# EAGLE design uknc_sd_fdd (EAGLE 6.6.0)
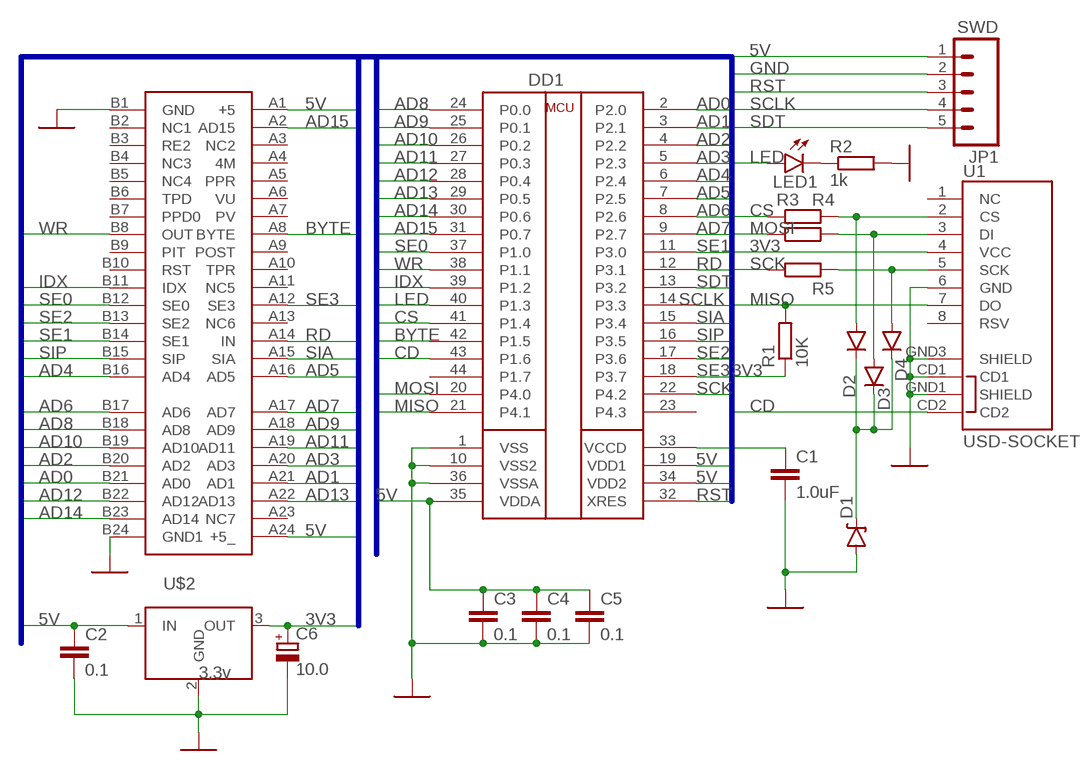
[diagram p0: schematic, sheet 1]

## Parts
C1  1.0uF  1.0UF-25V-+80/-20(0805)"  [0805-CAP]
C2  0.1  C-EUC0805  [C0805]
C3  0.1  C-EUC0805  [C0805]
C4  0.1  C-EUC0805  [C0805]
C5  0.1  C-EUC0805  [C0805]
C6  10.0  CPOL-EUE1.8-4  [E1,8-4]
D1  DIODE-ZENERPTH  [DIODE-ZENER]
D2  DIODEPTH  [DIODE-1N4001]
D3  DIODEPTH  [DIODE-1N4001]
D4  DIODEPTH  [DIODE-1N4001]
DD1  CY8C4245AXI  [TQFP-44]
JP1  SWD  M05PTH  [1X05]
LED1  LED1206  [LED-1206]
R1  10K  R-EU_M0805  [M0805]
R2  1k  R-EU_R0805  [R0805]
R3  R-EU_R0805  [R0805]
R4  R-EU_R0805  [R0805]
R5  R-EU_R0805  [R0805]
U1  USD-SOCKET  [MICROSD_1:1]
U$1  SNP  [SNP15-48-BOARD]
U$2  3.3v  1235B  [1235B]

## Nets
3V3: C6.+ R1.1 U1.4(VCC) U$2.3(OUT)
5V: C2.1 C3.1 C4.1 C5.1 DD1.19(VDD1) DD1.34(VDD2) DD1.35(VDDA) JP1.1 U$1.A1(+5) U$1.A24(+5_) U$2.1(IN)
AD0: DD1.2(P2.0) U$1.B21(AD0)
AD1: DD1.3(P2.1) U$1.A21(AD1)
AD2: DD1.4(P2.2) U$1.B20(AD2)
AD3: DD1.5(P2.3) U$1.A20(AD3)
AD4: DD1.6(P2.4) U$1.B16(AD4)
AD5: DD1.7(P2.5) U$1.A16(AD5)
AD6: DD1.8(P2.6) U$1.B17(AD6)
AD7: DD1.9(P2.7) U$1.A17(AD7)
AD8: DD1.24(P0.0) U$1.B18(AD8)
AD9: DD1.25(P0.1) U$1.A18(AD9)
AD10: DD1.26(P0.2) U$1.B19(AD10)
AD11: DD1.27(P0.3) U$1.A19(AD11)
AD12: DD1.28(P0.4) U$1.B22(AD12)
AD13: DD1.29(P0.5) U$1.A22(AD13)
AD14: DD1.30(P0.6) U$1.B23(AD14)
AD15: DD1.31(P0.7) U$1.A2(AD15)
BYTE: DD1.42(P1.5) U$1.A8(BYTE)
CD: DD1.43(P1.6) U1.CD2
CS: DD1.41(P1.4) R3.1
GND: C1.2 C2.2 C3.2 C4.2 C5.2 C6.- D1.P$2(A) DD1.1(VSS) DD1.10(VSS2) DD1.36(VSSA) JP1.2 R2.2 U1.6(GND) U1.CD1 U1.GND1(SHIELD) U1.GND3(SHIELD) U$1.B1(GND) U$1.B24(GND1) U$2.2(GND)
IDX: DD1.39(P1.2) U$1.B11(IDX)
LED: DD1.40(P1.3) LED1.A
MISO: DD1.21(P4.1) R1.2 U1.7(DO)
MOSI: DD1.20(P4.0) R4.1
N$1: C1.1 DD1.33(VCCD)
N$2: D1.P$1(C) D2.C D3.C D4.C
N$3: LED1.C R2.1
N$4: D2.A R3.2 U1.2(CS)
N$5: D3.A R4.2 U1.3(DI)
N$6: D4.A R5.2 U1.5(SCK)
RD: DD1.12(P3.1) U$1.A14(IN)
RST: DD1.32(XRES) JP1.3
SCK: DD1.22(P4.2) R5.1
SCLK: DD1.14(P3.3) JP1.4
SDT: DD1.13(P3.2) JP1.5
SE0: DD1.37(P1.0) U$1.B12(SE0)
SE1: DD1.11(P3.0) U$1.B14(SE1)
SE2: DD1.17(P3.6) U$1.B13(SE2)
SE3: DD1.18(P3.7) U$1.A12(SE3)
SIA: DD1.15(P3.4) U$1.A15(SIA)
SIP: DD1.16(P3.5) U$1.B15(SIP)
WR: DD1.38(P1.1) U$1.B8(OUT)
Unconnected: DD1.23(P4.3) DD1.44(P1.7) U1.1(NC) U1.8(RSV) U$1.A3(NC2) U$1.A4(4M) U$1.A5(PPR) U$1.A6(VU) U$1.A7(PV) U$1.A9(POST) U$1.A10(TPR) U$1.A11(NC5) U$1.A13(NC6) U$1.A23(NC7) U$1.B2(NC1) U$1.B3(RE2) U$1.B4(NC3) U$1.B5(NC4) U$1.B6(TPD) U$1.B7(PPD0) U$1.B9(PIT) U$1.B10(RST)

## Buses
B$1

## Library data of the parts
C1 = SparkFun-Capacitors:1.0UF-25V-+80/-20(0805): CAP-11625; PROD_ID: CAP-11625
C2-C5 = resistor:C-EU: CAPACITOR, European symbol
C6 = resistor:CPOL-EU: POLARIZED CAPACITOR, European symbol
D1 = SparkFun-DiscreteSemi:DIODE-ZENER: Zener Diode Production Part - 8199 3.4V Zener Voltage
D2-D4 = SparkFun-DiscreteSemi:DIODE: Diode These are standard reverse protection diodes and small signal diodes. SMA package can handle up to about 1A. SOD-323 can handle about 200mA. What the SOD-323 package when ordering, there are some mfgs out there that are 5-pin packages.
DD1 = CYP:CY8C4245AXI: CY8C4245AXI IN TQFP-44 PACKAGE
JP1 = SparkFun-Connectors:M05: Header 5 Standard 5-pin 0.1" header. Use with straight break away headers (SKU : PRT-00116), right angle break away headers (PRT-00553), swiss pins (PRT-00743), machine pins (PRT-00117), and female headers (PRT-00115). Molex polarized connector foot print use with SKU : PRT-08230 with associated crimp pins and housings.
LED1 = SparkFun-LED:LED: LEDs Standard schematic elements and footprints for 5mm, 3mm, 1206, and 0603 sized LEDs. 5mm - Spark Fun Electronics SKU : COM-00529 (and others)
R1-R5 = resistor:R-EU_: RESISTOR, European symbol
U1 = SparkFun-Connectors:USD-SOCKET: microSD Socket Push-push type uSD socket. Schematic element and footprint production proven. Spark Fun Electronics SKU : PRT-00127. tDoc lines correctly indicate media card edge positions when inserting (unlocked, locked, depressed). NOTE: CD1 and CD2 are connected internally; PROD_ID: CONN-07820
U$1 = connectors:SNP
U$2 = stab:1235B: Belarussian 3.3v stabilizer

## Board
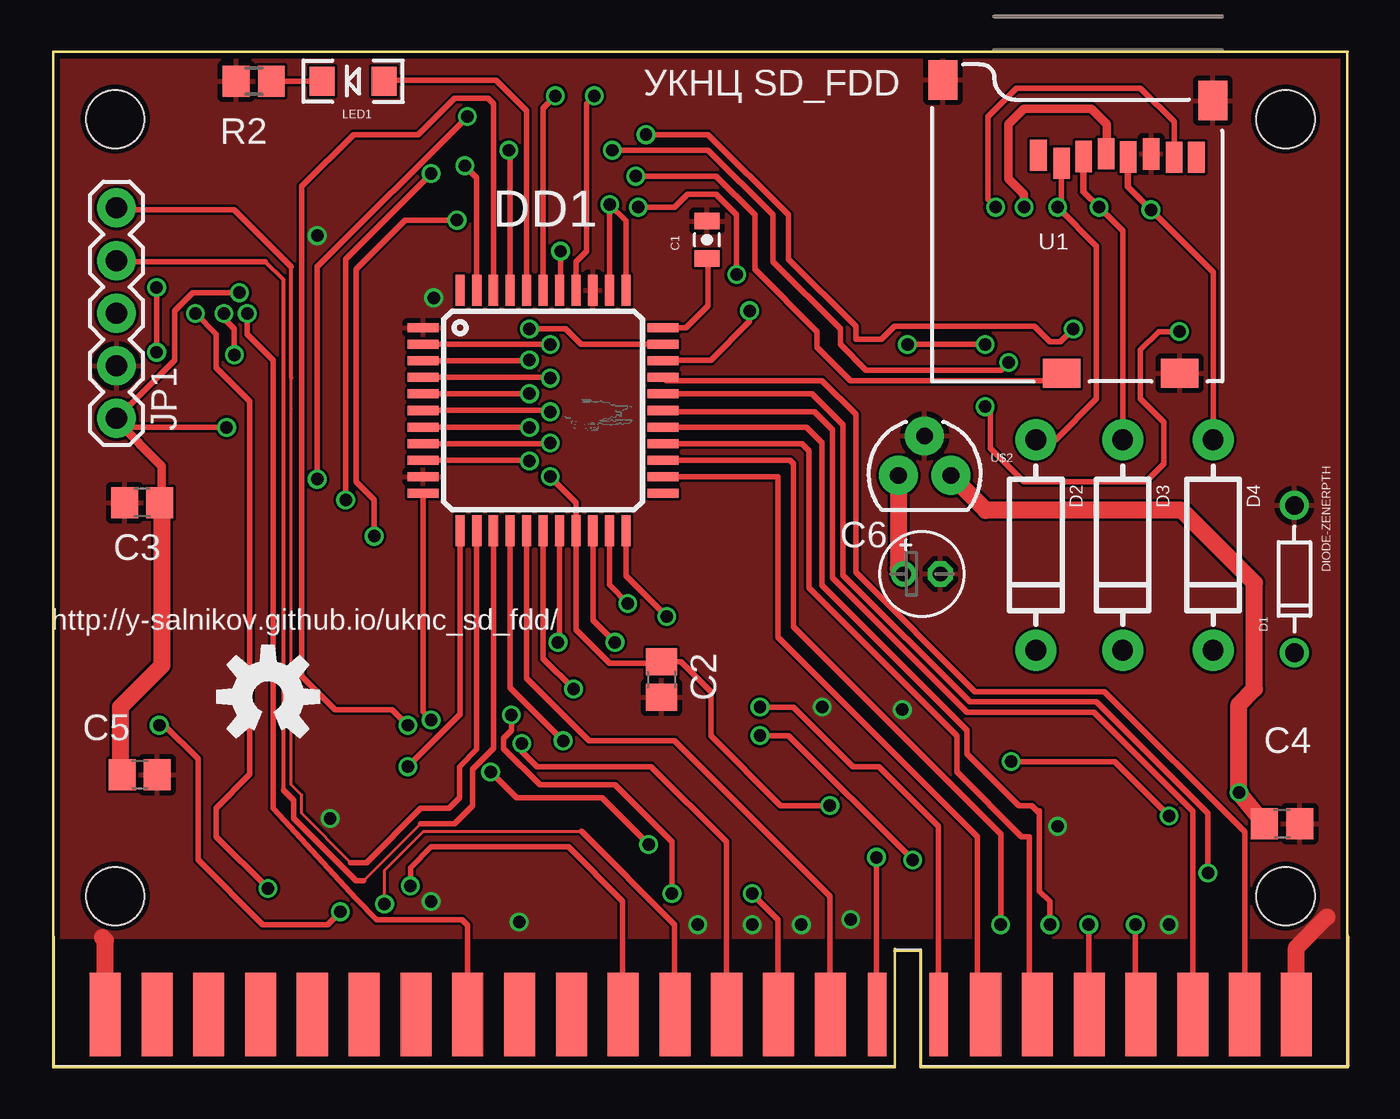
[diagram p1: board, top side]
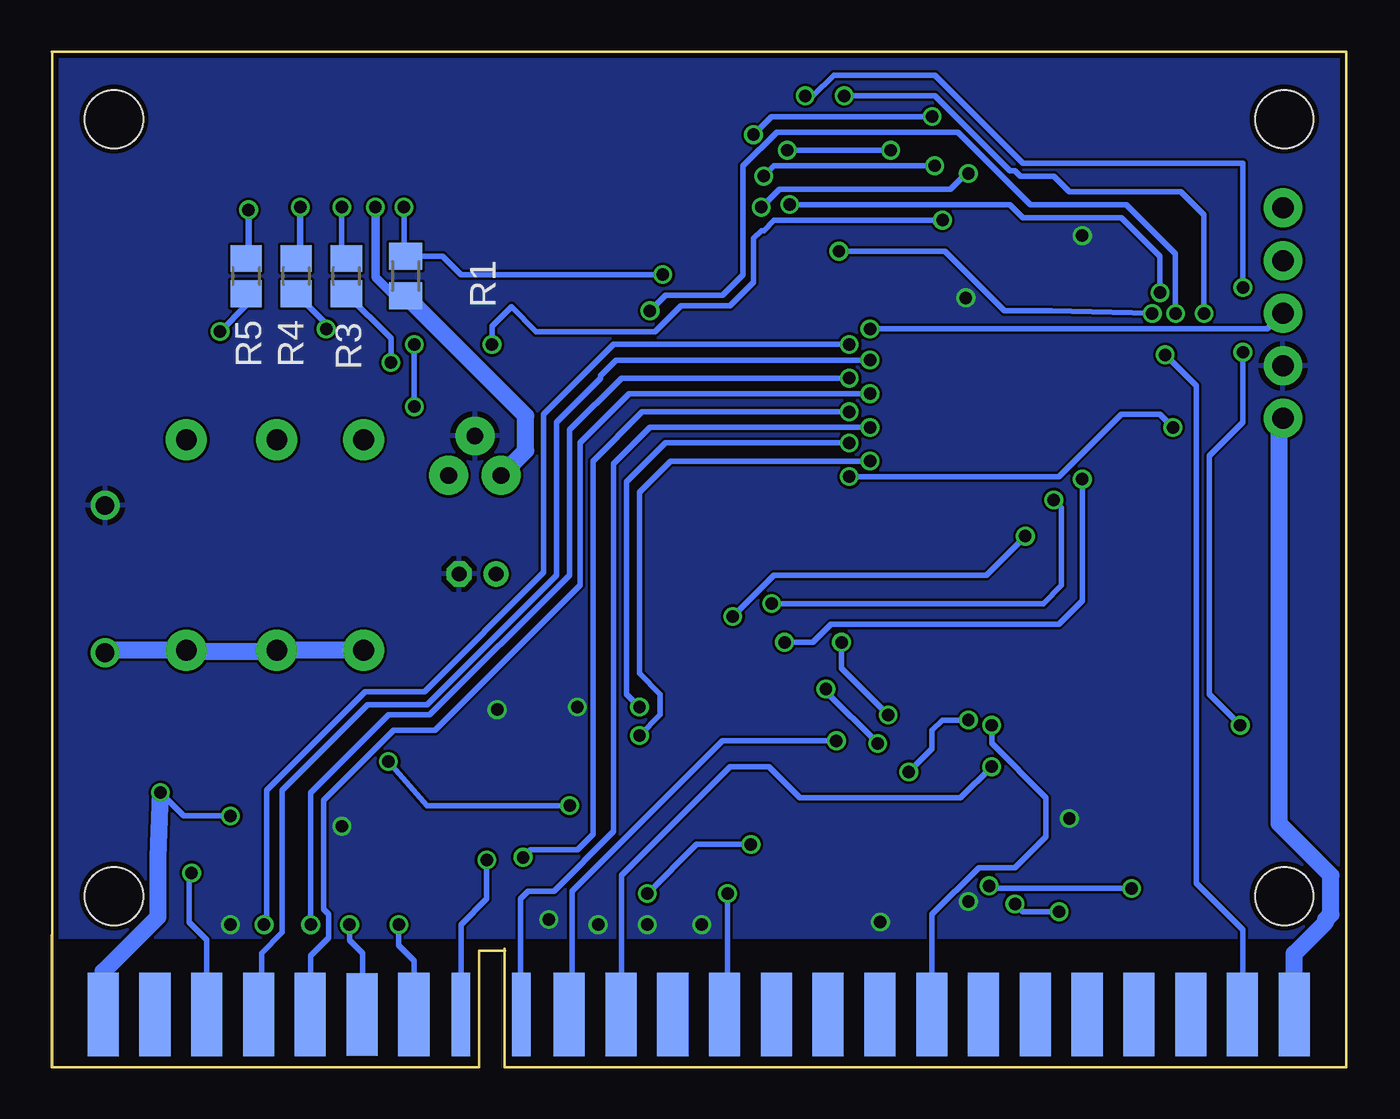
[diagram p2: board, bottom side, seen from below]

Size 62.5 x 49 mm. Coordinates in mm from the lower left corner, seen from the top.
Outline: 62.48,0 62.48,49
Outline: 40.64,5.71 40.64,0 0,0 0,49 62.5,49
Outline: 40.62,5.62 41.88,5.62 41.88,0 62.48,0
Outline: 62.48,0 62.5,0 62.5,6.38
Copper layers (1*16): Top 0.035mm / dielectric 1.5mm / Bottom 0.035mm
Design rules "dirt_cheap_dirty_boards.v1": minimum track width 5mil, minimum drill 12mil, track to track 5mil, track to pad 5mil, pad to pad 5mil, via to via 5mil, smd to smd 0mil, copper to edge 10mil, drill to drill 10mil, minimum pad ring 10mil, minimum via ring 6mil, stop-mask expansion 2mil, vias tented up to drill 25mil, thermal gap 10mil
Holes 2.8 mm at 3,45.75 59.5,45.75 3,8.25 59.5,8.25

### Footprints (pad centres in the part's own frame; a part is rotated, then mirrored left to right if it is on the bottom)
0805-CAP = smd 0.8 x 1.2: 1 -0.9,0; 2 0.9,0
C0805 = smd 1.3 x 1.5: 1 -0.85,0; 2 0.85,0
E1,8-4 = drill 0.711 pad 1.168: + -0.889,0 | drill 0.711 pad 1.168 octagon: - 0.889,0
DIODE-ZENER = drill 0.9: P$1 -3.556,0; P$2 3.556,0
DIODE-1N4001 = drill 1 pad 1.981: A -5.08,0; C 5.08,0
TQFP-44 = smd 1.5 x 0.44: 1 -5.8,4; 2 -5.8,3.2; 3 -5.8,2.4; 4 -5.8,1.6; 5 -5.8,0.8; 6 -5.8,0; 7 -5.8,-0.8; 8 -5.8,-1.6; 9 -5.8,-2.4; 10 -5.8,-3.2; 11 -5.8,-4; 23 5.8,-4; 24 5.8,-3.2; 25 5.8,-2.4; 26 5.8,-1.6; 27 5.8,-0.8; 28 5.8,0; 29 5.8,0.8; 30 5.8,1.6; 31 5.8,2.4; 32 5.8,3.2; 33 5.8,4 | smd 0.44 x 1.5: 12 -4,-5.8; 13 -3.2,-5.8; 14 -2.4,-5.8; 15 -1.6,-5.8; 16 -0.8,-5.8; 17 0,-5.8; 18 0.8,-5.8; 19 1.6,-5.8; 20 2.4,-5.8; 21 3.2,-5.8; 22 4,-5.8; 34 4,5.8; 35 3.2,5.8; 36 2.4,5.8; 37 1.6,5.8; 38 0.8,5.8; 39 0,5.8; 40 -0.8,5.8; 41 -1.6,5.8; 42 -2.4,5.8; 43 -3.2,5.8; 44 -4,5.8
1X05 = drill 1.016 pad 1.88: 1 0,0; 2 2.54,0; 3 5.08,0; 4 7.62,0; 5 10.16,0
LED-1206 = smd 1.2 x 1.4: A -1.5,0; C 1.5,0
M0805 = smd 1.3 x 1.6: 1 -0.95,0; 2 0.95,0
R0805 = smd 1.3 x 1.5: 1 -0.85,0; 2 0.85,0
MICROSD_1:1 = smd 0.8 x 1.5: 1 5.096,10.919; 2 6.218,10.519; 3 7.274,10.853; 4 8.367,10.982; 5 9.421,10.828; 6 10.539,10.973; 7 11.648,10.819; 8 12.721,10.819 | smd 1.8 x 1.4: CD1 11.92,0.4; CD2 6.22,0.4 | smd 1.4 x 1.9: GND1 0.497,14.55; GND3 13.52,13.55
SNP15-48-BOARD = smd 1.5 x 4.038 bottom: A1 1.25,0; A2 3.75,0; A3 6.25,0; A4 8.75,0; A5 11.25,0; A6 13.75,0; A7 16.25,0; A8 18.75,0; A9 21.25,0; A10 23.75,0; A11 26.25,0; A12 28.75,0; A13 31.25,0; A14 33.75,0; A15 36.25,0; A18 43.75,0; A20 48.75,0; A21 51.25,0; A22 53.75,0; A23 56.25,0; A24 58.75,0 | smd 0.895 x 4.038 bottom: A16 38.572,0; A17 41.479,0 | smd 1.5 x 3.962 bottom: A19 46.25,0 | smd 1.5 x 4.038: B1 1.25,0; B2 3.75,0; B3 6.25,0; B4 8.75,0; B5 11.25,0; B6 13.75,0; B7 16.25,0; B8 18.75,0; B9 21.25,0; B10 23.75,0; B11 26.25,0; B12 28.75,0; B13 31.25,0; B14 33.75,0; B15 36.25,0; B18 43.75,0; B19 46.25,0; B20 48.75,0; B21 51.25,0; B22 53.75,0; B23 56.25,0; B24 58.75,0 | smd 0.895 x 4.038: B16 38.521,0; B17 41.479,0
1235B = drill 0.813 pad 1.88: 1 1.27,0; 2 0,1.905; 3 -1.27,0

### Placement (x,y rotation side)
C1  31.57,39.93 90 top
C2  29.37,18.71 270 top
C3  4.3,27.25 180 top
C4  59.33,11.76 0 top
C5  4.18,14.12 0 top
C6  41.95,23.8 0 top
D1  59.92,23.55 90 top
D2  47.45,25.2 270 top
D3  51.63,25.2 270 top
D4  56.01,25.2 270 top
DD1  23.66,31.69 0 top
JP1  3.06,31.3 90 top
LED1  14.48,47.58 180 top
R1  45.42,38.18 90 bottom
R2  9.69,47.58 180 top
R3  48.28,38.17 90 bottom
R4  50.7,38.17 90 bottom
R5  53.11,38.17 90 bottom
U1  42.47,33.09 0 top
U$1  1.27,2.54 0 top
U$2  42.08,28.55 0 top
U$10  [OSHW-LOGO-M]  10.38,17.88 0 top

### Tracks (layer width: path | path; a pad name or v marks a point on that pad's centre or on a via)
3V3  (via drill 0.6)
  Top 0.406: v46.88,41.5 46.88,42.12 46.12,42.88 46.12,45.5 46.88,46.25 50.12,46.25 50.88,45.5 50.88,44.12 U1.4
  Top 0.813: U$2.3 40.8,24.06 C6.+
  Bottom 0.406: R1.1 45.98,37.23 46.88,38.12 v46.88,41.5
  Bottom 0.813: U$2.3 40.8,28.57 39.62,29.75 39.62,31.43 R1.1
5V  (via drill 0.6)
  Top 0.254: DD1.19 | DD1.35 26.86,41.6 v26.88,41.62 27.66,40.84 DD1.34 | v9,37.38 6.75,37.38 5.88,36.5 5.88,34.12 JP1.1 3.49,30.88 v8.38,30.88 | DD1.19 25.25,21.12 26.88,19.5 29.31,19.5 C2.1 30.32,19.56 31.75,18.12 31.75,16 35.12,12.62 v37.5,12.62 | DD1.19 25.25,27.25 v24,28.5 | v46.25,14.75 51.25,14.75 v53.88,12.12
  Top 0.406: JP1.1 3.06,31.19 5.25,29 5.25,27.21 C3.1
  Top 0.813: 5.25,27.21 5.25,19.38 3.25,17.38 3.25,14.21 C5.1 | C4.1 v57.25,13.25 57.25,17.5 58,18.25 58,23.38 54.5,26.88 45.02,26.88 U$2.1
  Bottom 0.254: v26.88,41.62 16.25,41.62 15.62,41 10.88,41 9,39.12 v9,37.38 | v24,28.5 13.88,28.5 10.88,31.5 9,31.5 v8.38,30.88 | v37.5,12.62 44.38,12.62 v46.25,14.75 | v53.88,12.12 56.12,12.12 v57.25,13.25
  Bottom 0.813: U$1.A24 60.02,4.61 57.38,7.25 57.38,10.12 v57.25,13.25 | U$1.A1 2.52,5.48 1,7 1,7.12 0.75,7.38 0.75,9.25 3.25,11.75 3.25,31.11 JP1.1
AD0  (via drill 0.6)
  Top 0.254: DD1.2 23.98,34.89 v24,34.88 | v52.25,6.88 52.25,3.5 52.5,3.25 52.5,2.56 U$1.B21
  Bottom 0.254: v24,34.88 35.38,34.88 38.75,31.5 38.75,23.88 44.5,18.12 47.38,18.12 52.12,13.38 52.12,7 v52.25,6.88
AD1  (via drill 0.6)
  Top 0.254: DD1.3 22.96,34.09 v23,34.12
  Bottom 0.254: v23,34.12 35.25,34.12 36,33.38 36,33.25 38.12,31.12 38.12,23.75 44.38,17.5 47.25,17.5 51.38,13.38 51.38,6.5 52.38,5.5 52.38,2.69 U$1.A21
AD2  (via drill 0.6)
  Top 0.254: DD1.4 23.96,33.29 v24,33.25 | v50,6.88 50,2.56 U$1.B20
  Bottom 0.254: v24,33.25 35,33.25 37.5,30.75 37.5,23.75 44.25,17 46.25,17 50,13.25 v50,6.88
AD3  (via drill 0.6)
  Top 0.254: DD1.5 v22.99,32.49 v23,32.5
  Bottom 0.254: v23,32.5 34.62,32.5 37,30.12 37,23.25 44,16.25 46,16.25 49.38,12.88 49.38,7.62 49.12,7.38 49.12,6.25 50,5.38 50,2.56 U$1.A20
AD4  (via drill 0.6)
  Top 0.254: DD1.6 23.93,31.69 v24,31.62 | v39.75,10.12 39.75,2.58 U$1.B16
  Bottom 0.254: v24,31.62 34,31.62 36.38,29.25 36.38,11.25 37.12,10.5 39.38,10.5 v39.75,10.12 39.62,10.25
AD5  (via drill 0.6)
  Top 0.254: DD1.7 22.98,30.89 v23,30.88
  Bottom 0.254: U$1.A16 39.88,2.57 39.88,8.12 39.5,8.5 38.25,8.5 35.38,11.38 35.38,29.12 33.62,30.88 v23,30.88
AD6  (via drill 0.6)
  Top 0.254: DD1.8 23.96,30.09 v24,30.12 | v34.12,17.38 35.75,17.38 38.62,14.5 39.88,14.5 42.75,11.62 U$1.B17
  Bottom 0.254: v24,30.12 32.88,30.12 34.75,28.25 34.75,18 v34.12,17.38
AD7  (via drill 0.6)
  Top 0.254: DD1.9 22.96,29.29 v23,29.25 | v34.12,16 35.5,16 v41.5,10
  Bottom 0.254: v23,29.25 32.62,29.25 34.12,27.75 34.12,19 33.12,18 33.12,17 v34.12,16 | v41.5,10 41.5,8.12 42.75,6.88 U$1.A17
AD8
  Top 0.254: DD1.24 34.99,28.49 35,28.5 35,20.75 44.62,11.12 44.62,2.94 U$1.B18
AD9  (via drill 0.6)
  Top 0.254: DD1.25 35.59,29.29 35.75,29.12 35.75,21.25 45.75,11.25 v45.75,6.88
  Bottom 0.254: 44.62,2.94 U$1.A18 45,2.56 45,5.12 45.75,5.88 v45.75,6.88
AD10
  Top 0.254: DD1.26 36.16,30.09 36.5,29.75 36.5,23.12 43.62,16 43.62,14.25 46.75,11.12 47.12,11.12 47.12,2.94 U$1.B19
AD11  (via drill 0.6)
  Top 0.254: DD1.27 36.36,30.89 37.12,30.12 37.12,23.25 44.12,16.25 44.12,15.12 46.62,12.62 47.25,12.62 47.62,12.25 | v48.12,6.88 48.12,8 47.62,8.5 47.62,12.25 | 47.62,12.25 47.62,12.38
  Bottom 0.254: 47.25,2.81 U$1.A19 47.5,2.56 47.5,5.5 48.12,6.12 v48.12,6.88
AD12
  Top 0.254: U$1.B22 55.02,12.36 50.25,17.12 44.12,17.12 37.62,23.62 37.62,30.75 36.75,31.62 29.52,31.62 DD1.28
AD13  (via drill 0.6)
  Top 0.254: v55.75,9.38 55.75,12.25 50.38,17.62 44.25,17.62 38.12,23.75 38.12,31 36.62,32.5 DD1.29
  Bottom 0.254: U$1.A22 55.02,6.14 55.88,7 55.88,9.25 v55.75,9.38
AD14
  Top 0.254: U$1.B23 57.52,11.36 50.75,18.12 44.5,18.12 38.75,23.88 38.75,31.5 37.12,33.12 29.62,33.12 DD1.30
AD15  (via drill 0.6)
  Top 0.254: v33.62,36.5 33.62,36 31.75,34.12 29.49,34.12 DD1.31 | v8.25,36.38 8.25,36.12 8.75,35.62 v8.75,34.38
  Bottom 0.254: v8.75,34.38 7.25,32.88 7.25,8.88 5,6.62 5,2.56 U$1.A2 | v33.62,36.5 32.88,37.25 30.12,37.25 29.12,38.25 29.12,43.5 27.5,45.12 18.75,45.12 15.25,41.62 10.62,41.62 8.25,39.25 v8.25,36.38
BYTE  (via drill 0.6)
  Top 0.254: v17.12,16.5 16.38,17.25 13.62,17.25 12,18.88 12,42.5 14.5,45 17.62,45 19.38,46.75 21,46.75 21.25,46.49 DD1.42
  Bottom 0.254: v17.12,16.5 17.12,15.62 14.5,13 14.5,11.12 16,9.62 17.75,9.62 20,7.38 20,2.56 U$1.A8
CD  (via drill 0.6)
  Top 0.254: DD1.43 20.45,42.92 v19.88,43.5 | v28.12,43 32,43 33.88,41.12 33.88,38.5 36.88,35.5 36.88,34.75 38.5,33.12 48.32,33.12 U1.CD2
  Bottom 0.254: v19.88,43.5 27.62,43.5 v28.12,43
CS  (via drill 0.6)
  Top 0.254: DD1.41 22.05,44.2 v22,44.25 | v27,44.25 31.62,44.25 34.75,41.12 34.75,38.88 38,35.62 38,34.88 39.25,33.62 45.75,33.62 v46.12,34
  Bottom 0.254: v22,44.25 v27,44.25 | v46.12,34 46.12,35.17 R3.1
GND  (via drill 0.6)
  Top 0.813: U$1.B1 2.52,6.11 2.38,6.25 | U$1.B24 60.02,5.77 61.5,7.25
  other vias: 53.88,6.88 37.12,17.38 48.5,11.62 41,17.25 18.25,8 38.5,7.12 22.5,7 13.38,12 31.12,6.88 33.75,6.88 36.12,6.88 18.38,37.12 12.75,40.12
  pour Top: 0.12,48.88 62.38,48.88 62.38,6.25 0.12,6.25
  pour Bottom: 0.12,48.88 62.38,48.88 62.38,6.25 0.12,6.25
IDX  (via drill 0.6)
  Top 0.254: DD1.39 23.66,46.28 v24.25,46.88 | v6.88,36.38 7.88,35.38 7.88,33.75 9.5,32.12 9.5,14.12 7.88,12.5 7.88,11.12 v10.38,8.62 | v17.25,8.75 17.25,9.62 18.25,10.62 24.88,10.62 27.5,8 27.5,2.56 U$1.B11
  Bottom 0.254: v24.25,46.88 19.88,46.88 16.25,43.25 16,43.25 15.75,43 14.12,43 13.38,42.25 8,42.25 6.88,41.12 v6.88,36.38 | v10.38,8.62 17.12,8.62 v17.25,8.75
LED
  Top 0.254: DD1.40 22.86,46.15 21.38,47.62 16.03,47.62 LED1.A
MISO  (via drill 0.6)
  Top 0.254: U1.7 54.12,45.63 52.5,47.25 46.5,47.25 45.12,45.88 45.12,41.88 v45.5,41.5 | DD1.21 26.86,23.27 v27.75,22.38 | v14.12,27.38 14.12,39 v18.25,43.12 | v28.25,41.5 30,41.5 30.62,42.12 32,42.12 33,41.12 v33,38.25
  Bottom 0.254: v45.5,41.5 45.5,39.21 R1.2 43.62,39.12 42.75,38.25 v33,38.25 | v27.75,22.38 14.62,22.38 13.75,23.25 13.75,27 v14.12,27.38 | v18.25,43.12 18.38,43.12 19.12,42.38 27.38,42.38 v28.25,41.5
MOSI  (via drill 0.6)
  Top 0.254: DD1.20 26.05,21.57 v27.12,20.5 | v12.75,28.38 12.75,38.62 v20,45.88 | v28.62,45 31.62,45 35.5,41.12 35.5,39 38.75,35.75 38.75,35.12 40,35.12 40.62,35.75 47.38,35.75 48.12,35 48.62,35 v49.25,35.62
  Bottom 0.254: v27.12,20.5 25.75,20.5 24.88,21.38 13.88,21.38 12.75,22.5 v12.75,28.38 | v20,45.88 27.75,45.88 v28.62,45 | v49.25,35.62 49.25,35.88 R4.1
N$1
  Top 0.254: DD1.33 30.57,35.69 31.62,36.75 31.62,38.98 C1.1
N$2
  Bottom 0.254: 51.7,20.05 D3.C
  Bottom 0.813: D2.C D3.C | 51.7,20.05 55.94,20.05 D4.C 59.81,20.11 D1.P$1
N$3
  Top 0.254: R2.1 LED1.C
N$4  (via drill 0.6)
  Top 0.254: U1.2 48.69,41.69 v48.5,41.5 50.38,39.62 50.38,32.25 48.4,30.27 D2.A
  Bottom 0.254: v48.5,41.5 48.5,39.24 R3.2
N$5  (via drill 0.6)
  Top 0.254: D3.A 51.63,40.37 v50.5,41.5
  Top 0.305: U1.3 49.74,42.26 v50.5,41.5
  Bottom 0.305: v50.5,41.5 50.5,39.22 R4.2
N$6  (via drill 0.6)
  Top 0.254: D4.A 56.01,38.37 v53,41.38
  Top 0.305: U1.5 51.89,42.48 v53,41.38
  Bottom 0.305: v53,41.38 53,39.13 R5.2
RD  (via drill 0.6)
  Top 0.254: DD1.12 19.66,17.03 v17.12,14.5
  Bottom 0.254: U$1.A14 35,2.56 35,9.25 29.75,14.5 27.88,14.5 26.38,13 18.62,13 v17.12,14.5
RST  (via drill 0.6)
  Top 0.254: DD1.32 25.48,34.89 24.75,35.62 v23,35.62
  Bottom 0.254: v23,35.62 3.82,35.62 JP1.3
SCK  (via drill 0.6)
  Top 0.254: DD1.22 27.66,23.72 v29.62,21.75 | v15.5,25.62 15.5,27.38 14.62,28.25 14.62,38.5 17,40.88 v19.5,40.88 | v54.38,35.5 53.38,35.5 52.5,34.62 52.5,32.25 53.62,31.12 53.62,29.12 52.75,28.25 46.88,28.25 45.25,29.88 45.25,31.62 v45,31.88 | v45,34.88 v41.25,34.88
  Bottom 0.254: v29.62,21.75 27.62,23.75 17.38,23.75 v15.5,25.62 | v19.5,40.88 27.62,40.88 28.12,40.38 28.25,40.38 28.62,40 28.62,37.88 29.75,36.75 32.12,36.75 33.38,35.5 39.12,35.5 40.31,36.69 41.25,35.75 v41.25,34.88 | R5.1 53.11,36.77 v54.38,35.5 | v45,31.88 v45,34.88
SCLK
  Top 0.154: 17.75,11.75 15,9
  Top 0.2: 10.25,38.88 11.12,38 11.12,13.38
  Top 0.254: DD1.14 21.25,15.38 20.25,14.38 20.25,12.62 19.38,11.75 17.75,11.75 | 10.25,38.88 3.11,38.88 | 15,9 14.62,9 11.62,12 11.62,12.88 11.12,13.38
  Top 0.305: 3.11,38.88 JP1.4
SDT
  Top 0.14: 11.5,13.62 11.5,31.75
  Top 0.154: 14.38,9.88 12,12.25 12,13.12 11.5,13.62 | 11.5,31.75 11.5,33.25
  Top 0.2: 11.5,33.25 11.5,38.62
  Top 0.254: JP1.5 3.15,41.38 8.75,41.38 11.5,38.62 | DD1.13 20.45,15.33 19.62,14.5 19.62,13 19.12,12.5 17.75,12.5 15.12,9.88 14.38,9.88
  Top 0.305: 3.1,41.5 JP1.5
SE0  (via drill 0.6)
  Top 0.154: v16,7.88 16,9.5 17.88,11.38 25.5,11.38
  Top 0.254: DD1.37 25.25,38.88 25.75,39.38 25.75,46.5 v26.12,46.88 | v5,37.62 v5,34.5 | v5.12,16.5 5.38,16.5 7,14.88 7,10 10.12,6.88 13.25,6.88 v13.88,7.5 | 25.5,11.38 30,6.88 30,2.56 U$1.B12
  Bottom 0.254: v26.12,46.88 25.75,46.88 24.75,47.88 19.88,47.88 15.62,43.62 5,43.62 v5,37.62 | v5,34.5 5,31.12 6.62,29.5 6.62,18 v5.12,16.5 | v13.88,7.5 15.62,7.5 v16,7.88
SE1  (via drill 0.6)
  Top 0.254: DD1.11 17.86,17.14 v18.25,16.75 | v28.75,10.75 26.5,13 22.38,13 v21.12,14.25 | v33.75,8.38 35,7.12 35,2.56 U$1.B14
  Bottom 0.254: v18.25,16.75 19.5,16.75 20,16.25 20,15.38 v21.12,14.25 | v28.75,10.75 31.38,10.75 v33.75,8.38
SE2  (via drill 0.6)
  Top 0.254: DD1.17 23.66,19.72 v25.12,18.25 | v22.62,15.62 22.62,15.25 23.38,14.5 28.88,14.5 32.5,10.88 32.5,2.56 U$1.B13
  Bottom 0.254: v25.12,18.25 25.12,18.12 v22.62,15.62
SE3  (via drill 0.6)
  Top 0.254: DD1.18 24.45,20.58 v24.38,20.5 | v22.12,17 22.12,16.25 21.75,15.88 21.75,15.38 23.5,13.62 27.12,13.62 29.88,10.88 v29.88,8.38
  Bottom 0.254: v24.38,20.5 24.38,19.25 v22.12,17 | v29.88,8.38 29.88,2.69 U$1.A12
SIA  (via drill 0.6)
  Top 0.254: DD1.15 22.05,18.32 v24.62,15.75
  Bottom 0.254: v24.62,15.75 30.12,15.75 37.38,8.5 37.38,2.69 U$1.A15
SIP
  Top 0.254: DD1.16 22.86,18.77 25.88,15.75 30,15.75 37.5,8.25 37.5,2.56 U$1.B15
WR  (via drill 0.6)
  Top 0.254: U$1.B8 20.02,6.86 19.75,7.12 15.62,7.12 14.62,8.12 10.62,12.5 10.62,34.12 9.38,35.38 v9.38,36.38 | v24.5,39.38 24.5,37.53 DD1.38
  Bottom 0.254: v9.38,36.38 14.25,36.5 16.5,36.5 19.38,39.38 v24.5,39.38

### Text on the board
_tsilk: УКНЦ SD_FDD | http://y-salnikov.github.io/uknc_sd_fdd/